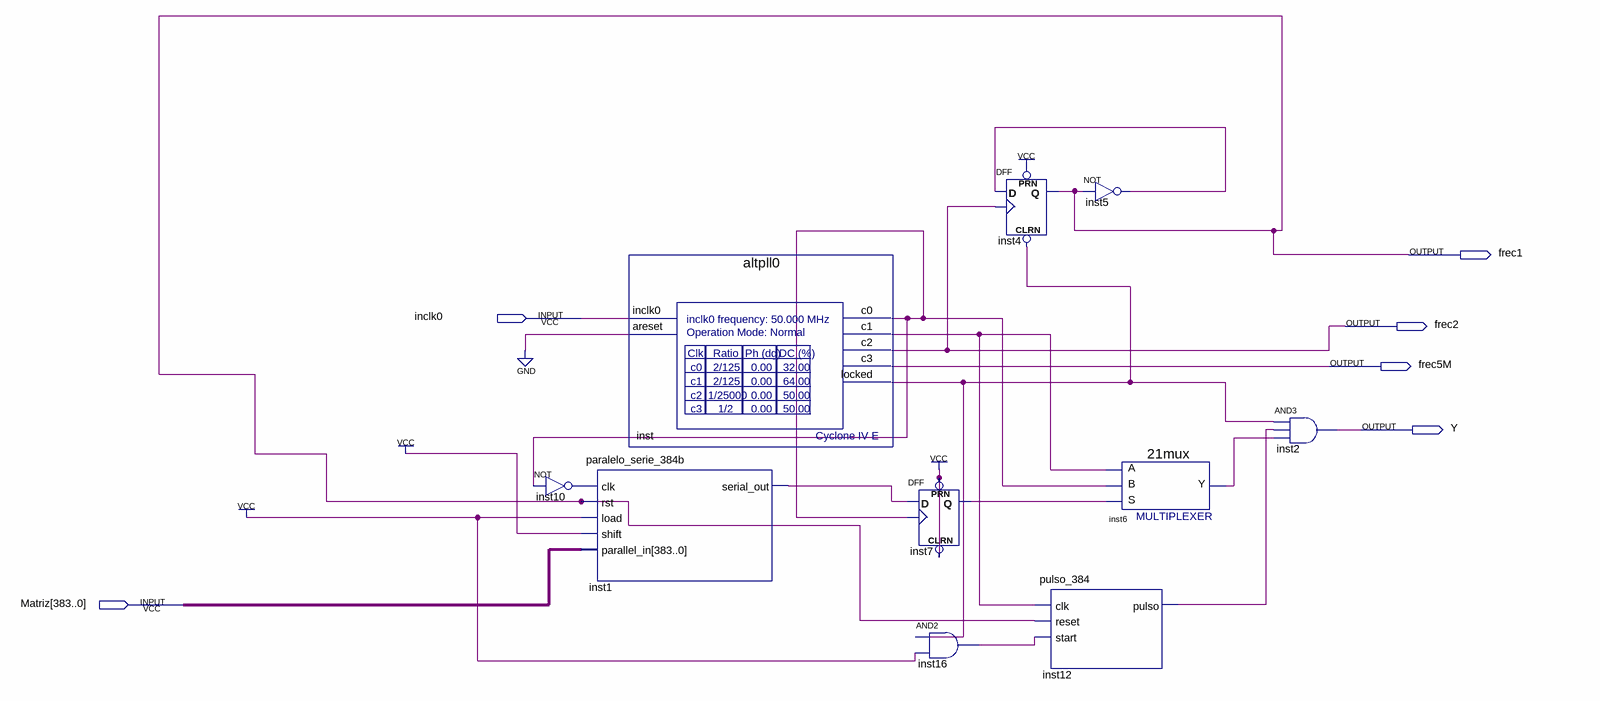
[diagram p0: schematic sheet]
// Quartus schematic Block1.bdf as structural Verilog: 10 symbols, 6 pins
module Block1 (
  input  inclk0,
  input  [383:0] Matriz,
  output frec1,
  output frec2,
  output frec5M,
  output Y
);

  wire inst1_serial_out, inst5_out, inst6_y, inst7_q, inst10_out, inst12_pulso, inst16_out, inst_c0, inst_c1,
       inst_locked;

  not inst10 (inst10_out, inst_c0);
  paralelo_serie_384b inst1 (
    .clk(inst10_out), .rst(frec1), .load(1'b1), .shift(1'b1), .parallel_in(Matriz),
    .serial_out(inst1_serial_out));
  altpll0 inst (
    .inclk0(inclk0), .areset(1'b0), .c0(inst_c0), .c1(inst_c1), .c2(frec2), .c3(frec5M), .locked(inst_locked));
  DFF inst7 (.CLRN(1'b1), .CLK(inst_c0), .D(inst1_serial_out), .PRN(1'b1), .Q(inst7_q));
  and inst16 (inst16_out, inst_locked, 1'b1);
  DFF inst4 (.CLRN(inst_locked), .CLK(frec2), .D(inst5_out), .PRN(1'b1), .Q(frec1));
  pulso_384 inst12 (.clk(inst_c1), .reset(frec1), .start(inst16_out), .pulso(inst12_pulso));
  not inst5 (inst5_out, frec1);
  \21mux  inst6 (.S(inst7_q), .B(inst_c0), .A(inst_c1), .Y(inst6_y));
  and inst2 (Y, inst_locked, inst12_pulso, inst6_y);
endmodule
